# EAGLE design Lighting Schematic (EAGLE 9.1.3)
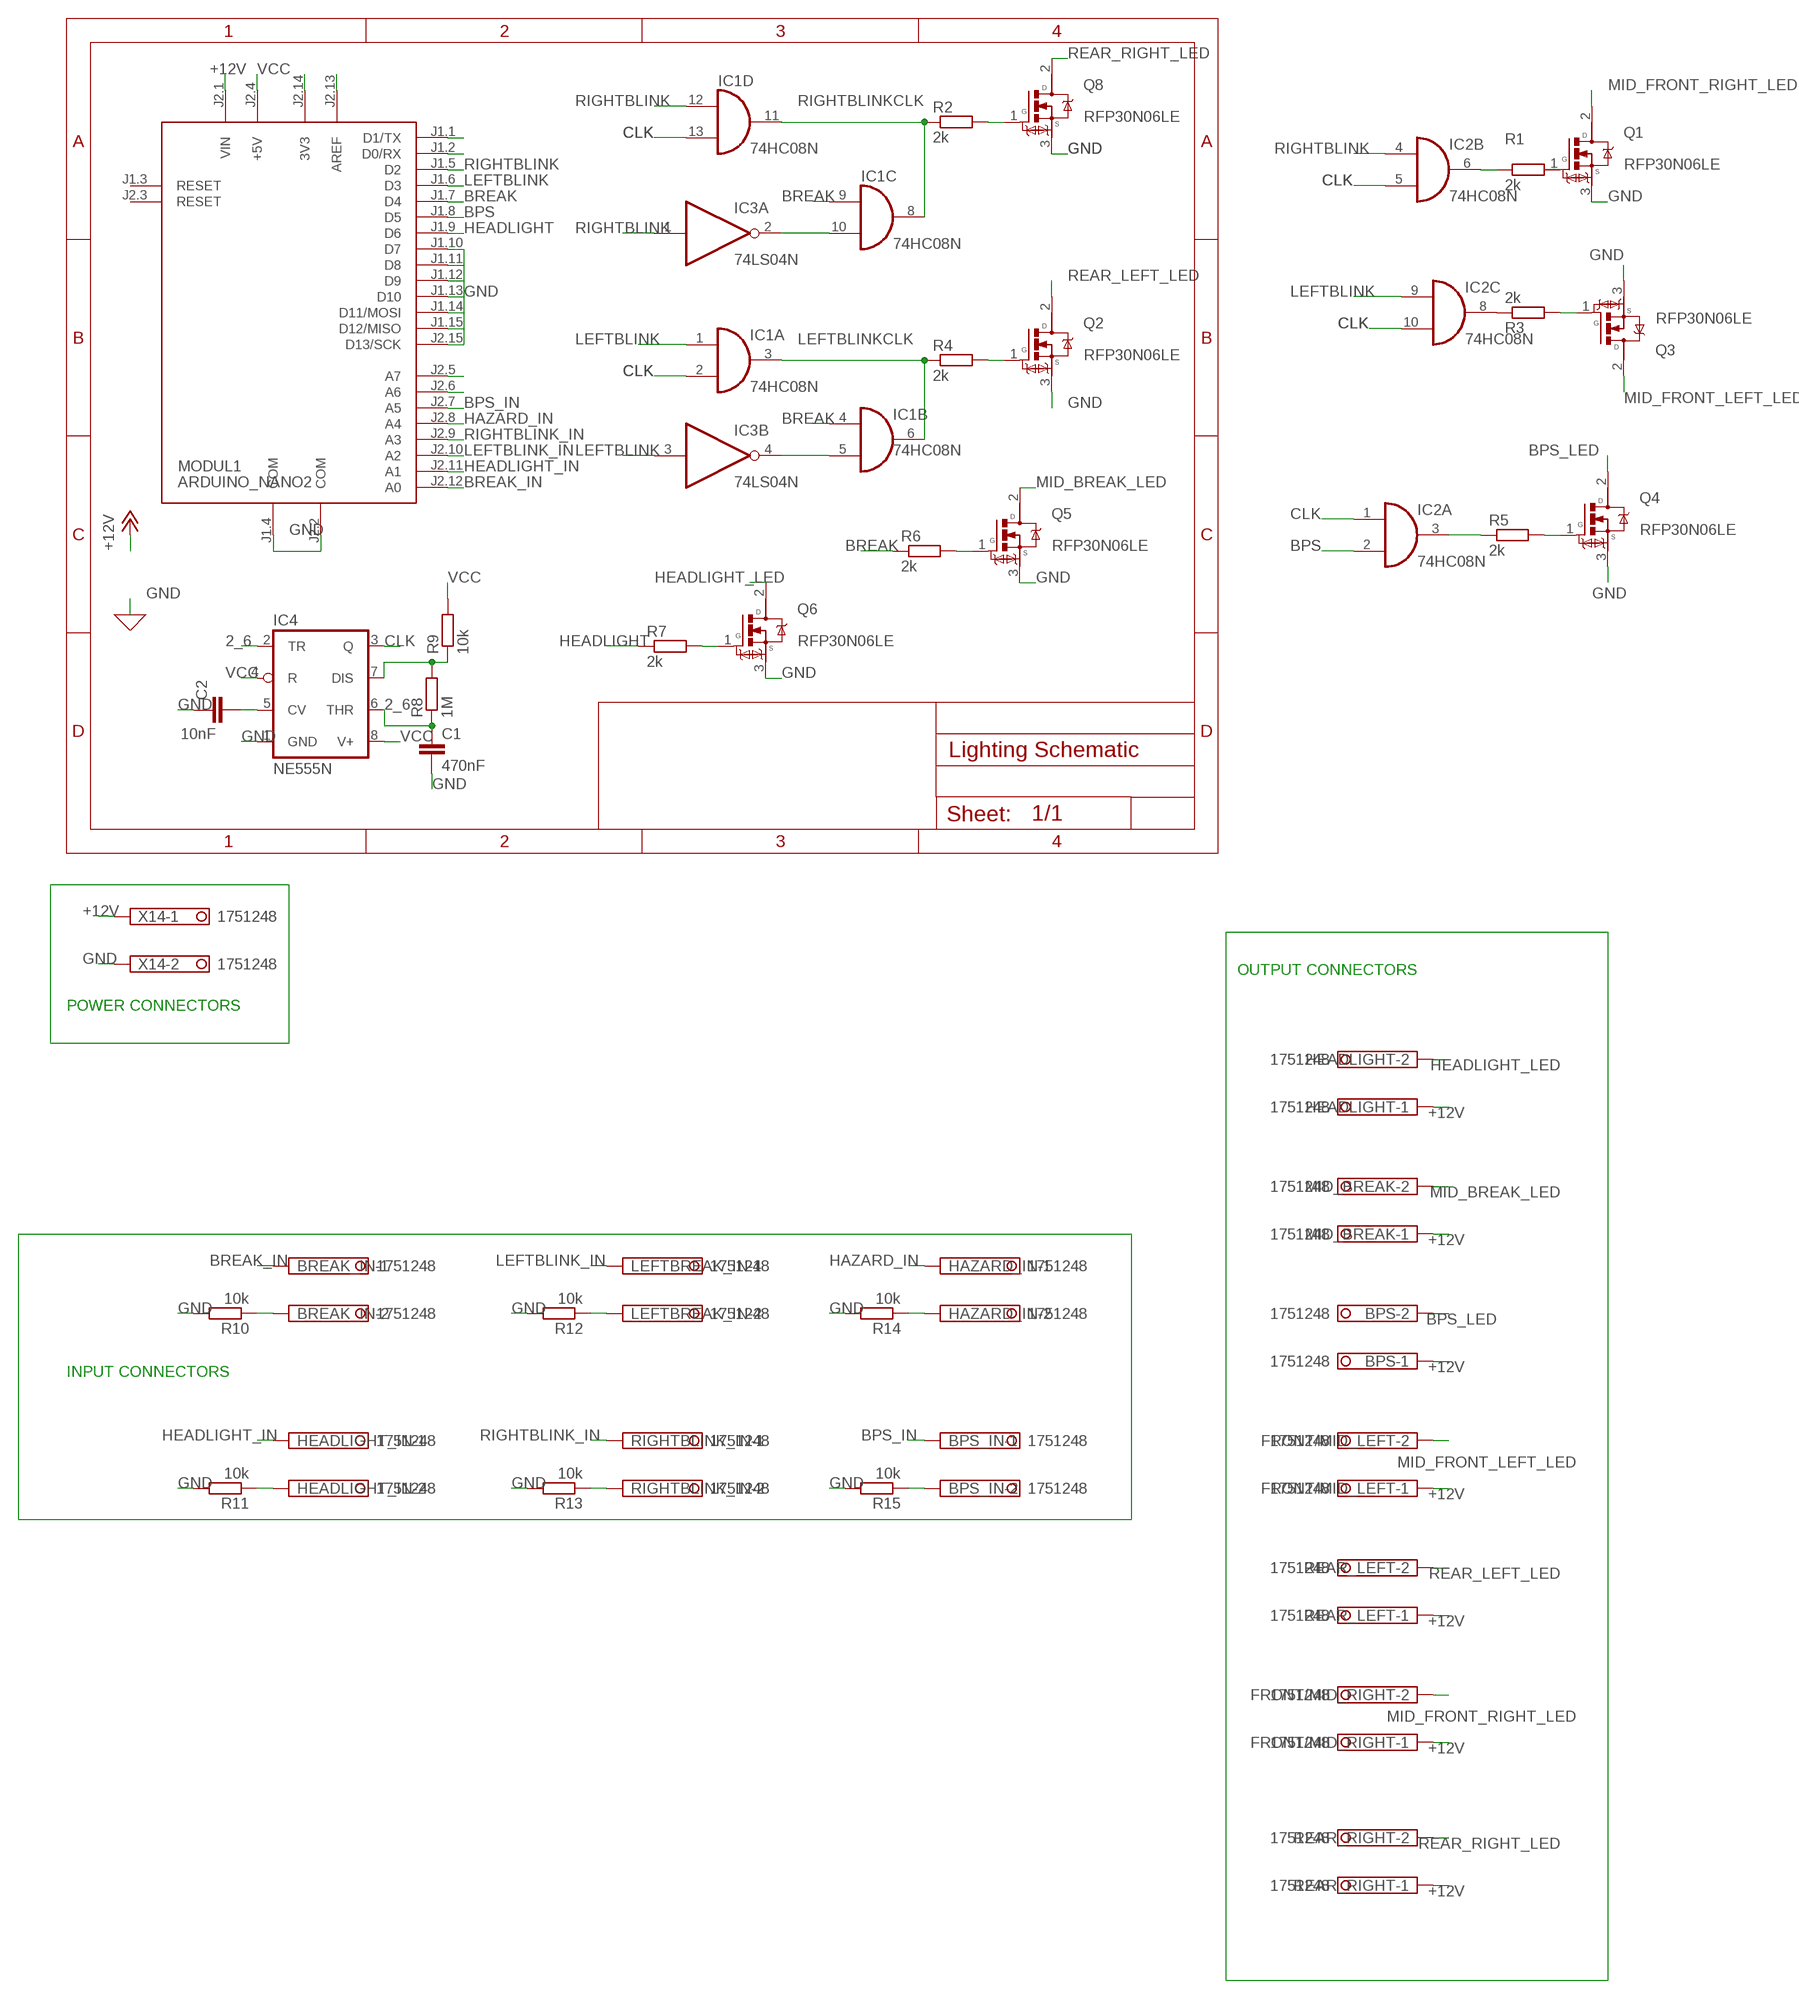
[diagram p0: schematic, sheet 1]

## Parts
BPS  1751248  [1751248]
BPS_IN  1751248  [1751248]
BREAK_IN  1751248  [1751248]
C1  470nF  C2.5/2  [C2.5-2]
C2  10nF  C2.5/2  [C2.5-2]
FRONT/MID_LEFT  1751248  [1751248]
FRONT/MID_RIGHT  1751248  [1751248]
HAZARD_IN  1751248  [1751248]
HEADLIGHT  1751248  [1751248]
HEADLIGHT_IN  1751248  [1751248]
IC1  74HC08N  [DIL14]
IC2  74HC08N  [DIL14]
IC3  74LS04N  [DIL14]
IC4  NE555N  [DIL08]
LEFTBREAK_IN  1751248  [1751248]
MID_BREAK  1751248  [1751248]
MODUL1  ARDUINO_NANO2  [ARDUINO_NANO2]
Q1  RFP30N06LE  [TRANS_RFP30N06LE]
Q2  RFP30N06LE  [TRANS_RFP30N06LE]
Q3  RFP30N06LE  [TRANS_RFP30N06LE]
Q4  RFP30N06LE  [TRANS_RFP30N06LE]
Q5  RFP30N06LE  [TRANS_RFP30N06LE]
Q6  RFP30N06LE  [TRANS_RFP30N06LE]
Q8  RFP30N06LE  [TRANS_RFP30N06LE]
R1  2k  R-EU_0204/5  [0204/5]
R2  2k  R-EU_0204/5  [0204/5]
R3  2k  R-EU_0204/5  [0204/5]
R4  2k  R-EU_0204/5  [0204/5]
R5  2k  R-EU_0204/5  [0204/5]
R6  2k  R-EU_0204/5  [0204/5]
R7  2k  R-EU_0204/5  [0204/5]
R8  1M  R-EU_0204/5  [0204/5]
R9  10k  R-EU_0204/5  [0204/5]
R10  10k  R-EU_0204/5  [0204/5]
R11  10k  R-EU_0204/5  [0204/5]
R12  10k  R-EU_0204/5  [0204/5]
R13  10k  R-EU_0204/5  [0204/5]
R14  10k  R-EU_0204/5  [0204/5]
R15  10k  R-EU_0204/5  [0204/5]
REAR_LEFT  1751248  [1751248]
REAR_RIGHT  1751248  [1751248]
RIGHTBLINK_IN  1751248  [1751248]
X14  1751248  [1751248]

## Nets
2_6: C1.1 IC4.2(TR) IC4.6(THR) R8.1
+12V: BPS.1 FRONT/MID_LEFT.1 FRONT/MID_RIGHT.1 HEADLIGHT.1 MID_BREAK.1 MODUL1.J2.1(VIN) REAR_LEFT.1 REAR_RIGHT.1 X14.1
BPS: IC2.2(A:I1) MODUL1.J1.8(D5)
BPS_IN: BPS_IN.1 MODUL1.J2.7(A5)
BPS_LED: BPS.2 Q4.2(D)
BREAK: IC1.4(B:I0) IC1.9(C:I0) MODUL1.J1.7(D4) R6.1
BREAK_IN: BREAK_IN.1 MODUL1.J2.12(A0)
CLK: IC1.2(A:I1) IC1.13(D:I1) IC2.1(A:I0) IC2.5(B:I1) IC2.10(C:I1) IC4.3(Q)
GND: C1.2 C2.1 IC4.1(GND) MODUL1.J1.4(COM) MODUL1.J1.10(D7) MODUL1.J2.2(COM) MODUL1.J2.15(D13/SCK) Q1.3(S) Q2.3(S) Q3.3(S) Q4.3(S) Q5.3(S) Q6.3(S) Q8.3(S) R10.2 R11.2 R12.2 R13.2 R14.2 R15.2 X14.2
HAZARD_IN: HAZARD_IN.1 MODUL1.J2.8(A4)
HEADLIGHT: MODUL1.J1.9(D6) R7.1
HEADLIGHT_IN: HEADLIGHT_IN.1 MODUL1.J2.11(A1)
HEADLIGHT_LED: HEADLIGHT.2 Q6.2(D)
LEFTBLINK: IC1.1(A:I0) IC2.9(C:I0) IC3.3(B:I) MODUL1.J1.6(D3)
LEFTBLINK_IN: LEFTBREAK_IN.1 MODUL1.J2.10(A2)
LEFTBLINKCLK: IC1.3(A:O) IC1.6(B:O) R4.1
MID_BREAK_LED: MID_BREAK.2 Q5.2(D)
MID_FRONT_LEFT_LED: FRONT/MID_LEFT.2 Q3.2(D)
MID_FRONT_RIGHT_LED: FRONT/MID_RIGHT.2 Q1.2(D)
N$1: Q8.1(G) R2.2
N$2: IC1.10(C:I1) IC3.2(A:O)
N$3: IC2.6(B:O) R1.1
N$4: IC1.5(B:I1) IC3.4(B:O)
N$5: IC4.7(DIS) R8.2 R9.1
N$6: Q2.1(G) R4.2
N$7: Q1.1(G) R1.2
N$8: Q3.1(G) R3.2
N$9: Q4.1(G) R5.2
N$10: IC2.3(A:O) R5.1
N$11: Q5.1(G) R6.2
N$12: Q6.1(G) R7.2
N$13: IC2.8(C:O) R3.1
N$28: MODUL1.J1.15(D12/MISO)
N$29: MODUL1.J1.14(D11/MOSI)
N$30: MODUL1.J1.13(D10)
N$31: MODUL1.J1.12(D9)
N$32: MODUL1.J1.11(D8)
N$34: C2.2 IC4.5(CV)
N$39: MODUL1.J1.2(D0/RX)
N$40: MODUL1.J1.1(D1/TX)
N$41: MODUL1.J2.5(A7)
N$42: MODUL1.J2.6(A6)
N$46: BREAK_IN.2 R10.1
N$48: HEADLIGHT_IN.2 R11.1
N$50: LEFTBREAK_IN.2 R12.1
N$51: MODUL1.J2.14(3V3)
N$52: MODUL1.J2.13(AREF)
N$54: R13.1 RIGHTBLINK_IN.2
N$56: HAZARD_IN.2 R14.1
N$58: BPS_IN.2 R15.1
REAR_LEFT_LED: Q2.2(D) REAR_LEFT.2
REAR_RIGHT_LED: Q8.2(D) REAR_RIGHT.2
RIGHTBLINK: IC1.12(D:I0) IC2.4(B:I0) IC3.1(A:I) MODUL1.J1.5(D2)
RIGHTBLINK_IN: MODUL1.J2.9(A3) RIGHTBLINK_IN.1
RIGHTBLINKCLK: IC1.8(C:O) IC1.11(D:O) R2.1
VCC: IC4.4(R) IC4.8(V+) MODUL1.J2.4(+5V) R9.2
Unconnected: IC2.11(D:O) IC2.12(D:I0) IC2.13(D:I1) IC3.5(C:I) IC3.6(C:O) IC3.8(D:O) IC3.9(D:I) IC3.10(E:O) IC3.11(E:I) IC3.12(F:O) IC3.13(F:I) MODUL1.J1.3(RESET) MODUL1.J2.3(RESET)

## Notes on the sheet
- OUTPUT CONNECTORS
- POWER CONNECTORS
- INPUT CONNECTORS

## Power pins joined to a net without a drawn wire
GND: IC1.7(P:GND) IC2.7(P:GND) IC3.7(P:GND)
VCC: IC1.14(P:VCC) IC2.14(P:VCC) IC3.14(P:VCC)

## Library data of the parts
BPS BPS_IN BREAK_IN FRONT/MID_LEFT FRONT/MID_RIGHT HAZARD_IN HEADLIGHT HEADLIGHT_IN LEFTBREAK_IN MID_BREAK REAR_LEFT REAR_RIGHT RIGHTBLINK_IN X14 = con-phoenix-350:1751248: MKDS 1/ 2-3,5 Printklemme Nennstrom: 10 A Bemessungsspannung: 160 V Raster: 3,5 mm Polzahl: 2 Montageart: Löten Anschlussart: Schraubanschluss Anschlussrichtung vom Leiter zur Platine: 0° Source: http://eshop.phoenixcontact.com .. 1751248.pdf; OC_FARNELL: unknown; OC_NEWARK: unknown
C1 C2 = capacitor-wima:C: CAPACITOR naming: grid - package width
IC1 IC2 = 74xx-eu:74*08: Quad 2-input AND gate
IC3 = 74xx-eu:74*04: Hex INVERTER
IC4 = linear:*555: TIMER
MODUL1 = arduino:ARDUINO_NANO2: Arduino Nano2 Auto generated by modulcreator.ulp \;; ANZAHL: 2; MODUL: TRUE; STECKX0: -76200; STECKX1: 76200; STECKY0: 177800; STECKY1: 177800
Q1-Q6 Q8 = RFP30N06LE:RFP30N06LE: Mosfet n-Ch 60v 30a To-220ab - Rfp30n06le; AVAILABILITY: Unavailable; DESCRIPTION: MOSFET N-CH 60V 30A TO-220AB; MF: ON Semiconductor; MP: RFP30N06LE; PACKAGE: TO-220 Intersil; PRICE: None
R1-R15 = rcl:R-EU_: RESISTOR, European symbol; SPICEPREFIX: R

## Board
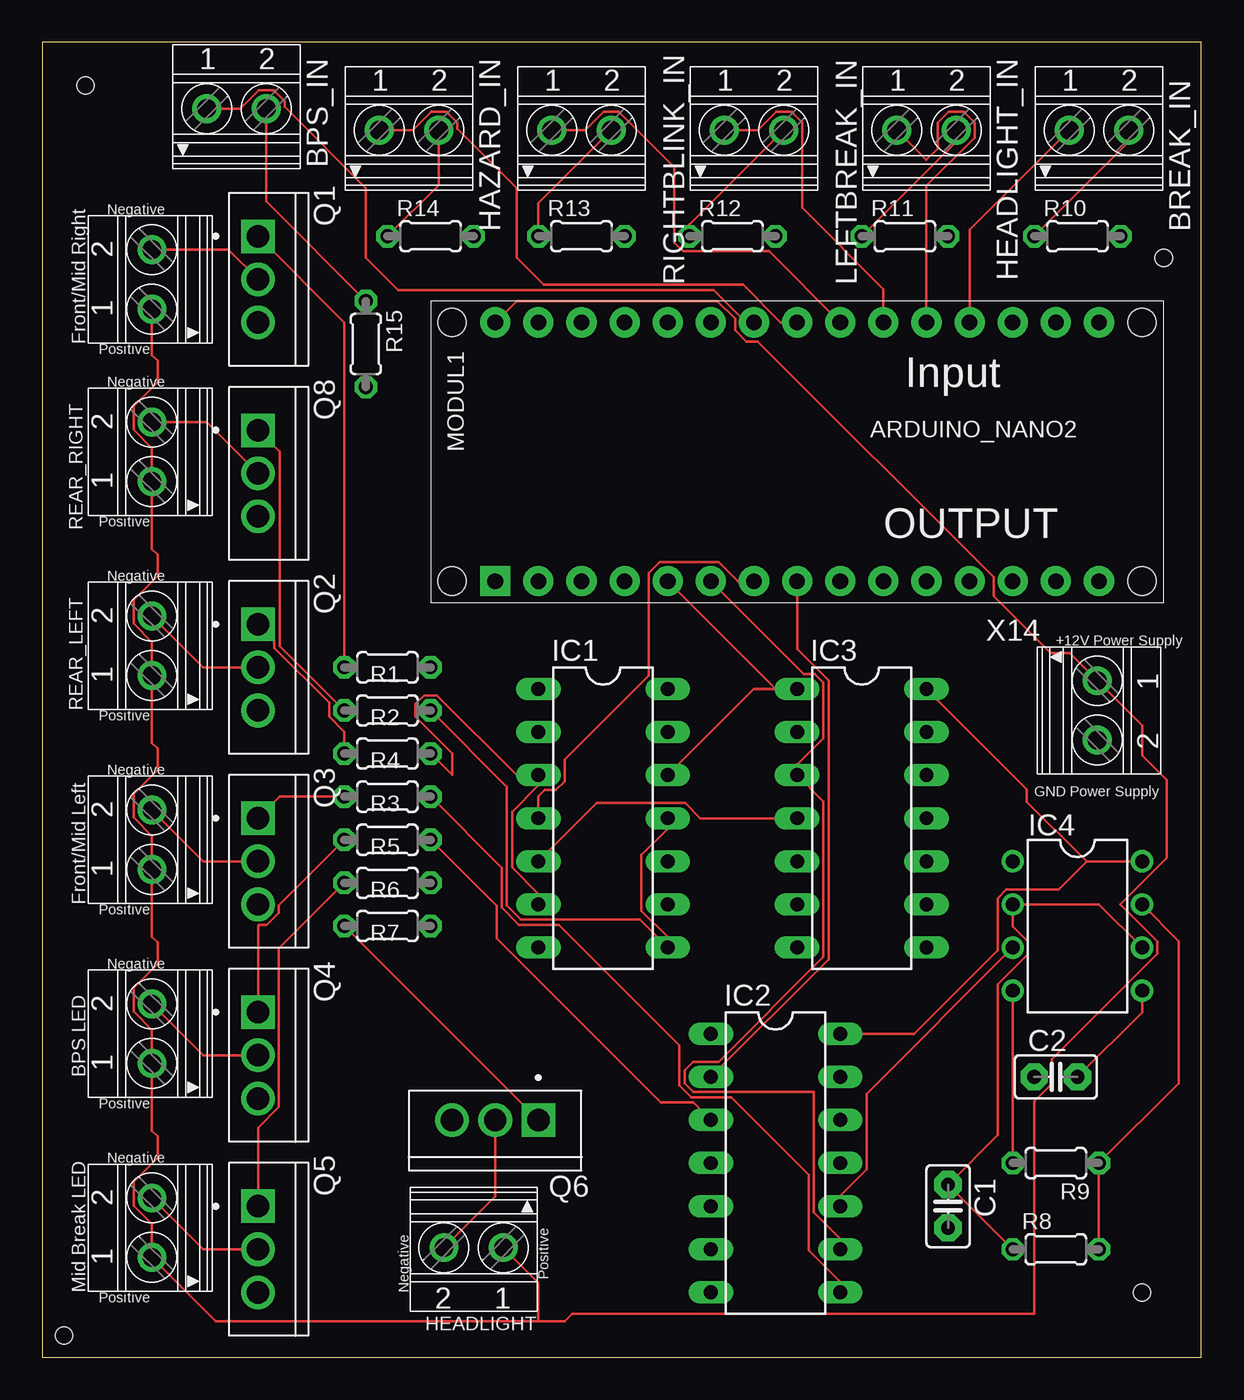
[diagram p1: board, top side]
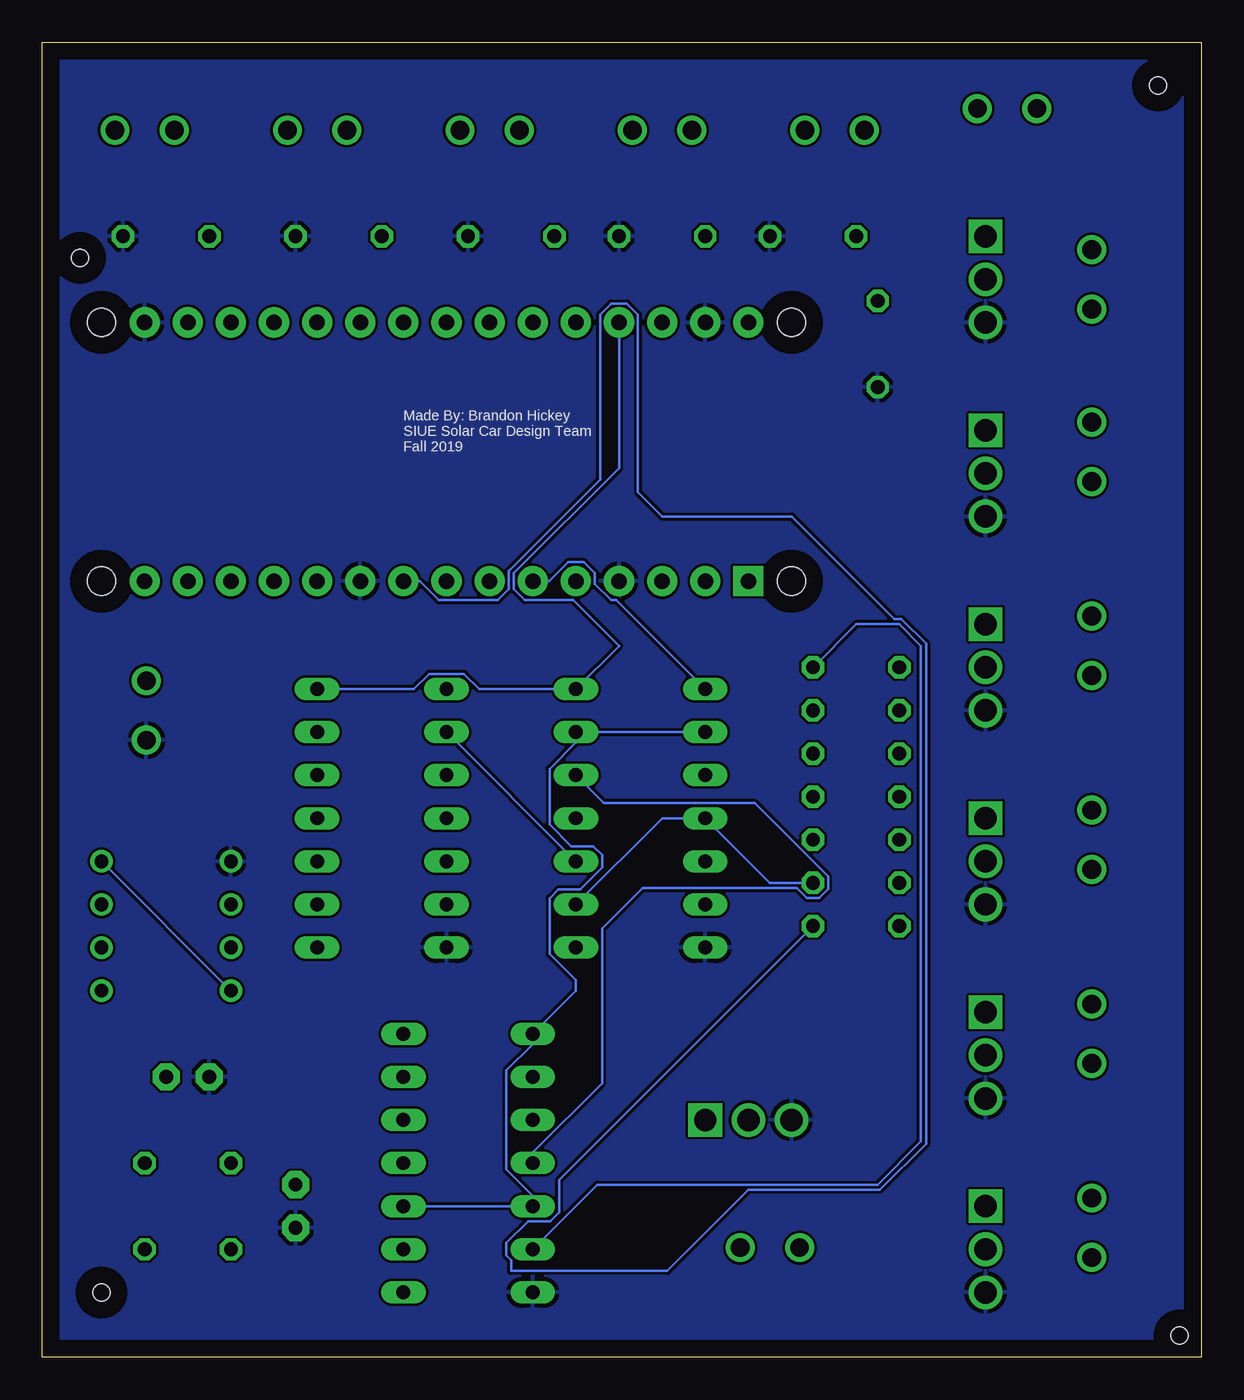
[diagram p2: board, bottom side, seen from below]

Size 68.25 x 77.46 mm. Coordinates in mm from the lower left corner, seen from the top.
Outline: 0,0 68.25,0 68.25,77.46 0,77.46 0,0
Copper layers (1*16): Top 0.035mm / dielectric 1.5mm / Bottom 0.035mm
Design rules "default": minimum track width 6mil, minimum drill 0.35mm, track to track 6mil, track to pad 6mil, pad to pad 6mil, via to via 6mil, smd to smd 6mil, copper to edge 40mil, drill to drill 6mil, minimum pad ring 10mil, minimum via ring 8mil, stop-mask expansion 4mil, vias tented up to drill 0mil, thermal gap 10mil
Holes 1 mm at 64.77,3.81 66.04,64.77 2.54,74.93 1.27,1.27

### Footprints (pad centres in the part's own frame; a part is rotated, then mirrored left to right if it is on the bottom)
1751248 = drill 1.1 pad 1.7: 1 -1.75,-0.1; 2 1.75,-0.1
C2.5-2 = drill 0.813 pad 1.6 octagon: 1 -1.27,0; 2 1.27,0
DIL14 = drill 0.813 long: 1 -7.62,-3.81; 2 -5.08,-3.81; 3 -2.54,-3.81; 4 0,-3.81; 5 2.54,-3.81; 6 5.08,-3.81; 7 7.62,-3.81; 8 7.62,3.81; 9 5.08,3.81; 10 2.54,3.81; 11 0,3.81; 12 -2.54,3.81; 13 -5.08,3.81; 14 -7.62,3.81
DIL08 = drill 0.813 pad 1.27: 1 -3.81,-3.81; 2 -1.27,-3.81; 3 1.27,-3.81; 4 3.81,-3.81; 5 3.81,3.81; 6 1.27,3.81; 7 -1.27,3.81; 8 -3.81,3.81
ARDUINO_NANO2 = drill 0.914 pad 1.778 square: J1.1 -7.62,17.78 | drill 0.914 pad 1.778: J1.2 -7.62,15.24; J1.3 -7.62,12.7; J1.4 -7.62,10.16; J1.5 -7.62,7.62; J1.6 -7.62,5.08; J1.7 -7.62,2.54; J1.8 -7.62,0; J1.9 -7.62,-2.54; J1.10 -7.62,-5.08; J1.11 -7.62,-7.62; J1.12 -7.62,-10.16; J1.13 -7.62,-12.7; J1.14 -7.62,-15.24; J1.15 -7.62,-17.78; J2.1 7.62,17.78; J2.2 7.62,15.24; J2.3 7.62,12.7; J2.4 7.62,10.16; J2.5 7.62,7.62; J2.6 7.62,5.08; J2.7 7.62,2.54; J2.8 7.62,0; J2.9 7.62,-2.54; J2.10 7.62,-5.08; J2.11 7.62,-7.62; J2.12 7.62,-10.16; J2.13 7.62,-12.7; J2.14 7.62,-15.24; J2.15 7.62,-17.78 | hole 1.651: -7.62,-20.32; 7.62,-20.32; 7.62,20.32; -7.62,20.32
TRANS_RFP30N06LE = drill 1.32 square: 1 -2.54,0 | drill 1.32: 2 0,0; 3 2.54,0
0204/5 = drill 0.813 octagon: 1 -2.54,0; 2 2.54,0

### Placement (x,y rotation side)
BPS  6.35,19.05 90 top
BPS_IN  11.43,73.66 0 top
BREAK_IN  62.23,72.39 0 top
C1  53.34,8.89 270 top
C2  59.69,16.51 0 top
FRONT/MID_LEFT  6.35,30.48 90 top
FRONT/MID_RIGHT  6.35,63.5 90 top
HAZARD_IN  21.59,72.39 0 top
HEADLIGHT  25.4,6.35 180 top
HEADLIGHT_IN  52.07,72.39 0 top
IC1  33.02,31.75 270 top
IC2  43.18,11.43 270 top
IC3  48.26,31.75 270 top
IC4  60.96,25.4 270 top
LEFTBREAK_IN  41.91,72.39 0 top
MID_BREAK  6.35,7.62 90 top
MODUL1  44.45,53.34 90 top
Q1  12.7,63.5 270 top
Q2  12.7,40.64 270 top
Q3  12.7,29.21 270 top
Q4  12.7,17.78 270 top
Q5  12.7,6.35 270 top
Q6  26.67,13.97 180 top
Q8  12.7,52.07 270 top
R1  20.32,40.64 180 top
R2  20.32,38.1 180 top
R3  20.32,33.02 180 top
R4  20.32,35.56 180 top
R5  20.32,30.48 180 top
R6  20.32,27.94 180 top
R7  20.32,25.4 180 top
R8  59.69,6.35 0 top
R9  59.69,11.43 180 top
R10  60.96,66.04 0 top
R11  50.8,66.04 0 top
R12  40.64,66.04 0 top
R13  31.75,66.04 0 top
R14  22.86,66.04 0 top
R15  19.05,59.69 270 top
REAR_LEFT  6.35,41.91 90 top
REAR_RIGHT  6.35,53.34 90 top
RIGHTBLINK_IN  31.75,72.39 0 top
X14  62.23,38.1 270 top

### Tracks (layer width: path | path; a pad name or v marks a point on that pad's centre or on a via)
2_6
  Top 0.152: R8.1 C1.1 56.26,13.08 56.26,21.96 58.04,23.74 58.04,24.5 57.15,25.39 IC4.2 62.23,26.67 IC4.6
+12V
  Top 0.152: MODUL1.J2.1 27.94,62.23 39.75,62.23 40.79,61.19 40.79,60.5 41.45,59.84 42.14,59.84 56.03,45.95 56.03,44.84 59.39,41.48 60.5,41.48 X14.1 64.77,37.21 64.77,35.45 66.22,33.99 66.22,29.41 63.49,26.67 65.66,24.5 65.66,23.76 59.45,17.55 59.45,16.08 58.42,15.05 58.42,2.54 31.21,2.54 30.78,2.11 29.21,2.11 | FRONT/MID_RIGHT.1 6.45,59.05 6.78,58.72 6.78,57.45 5.37,56.04 5.37,54.64 6.45,53.56 REAR_RIGHT.1 6.45,47.62 6.78,47.29 6.78,46.02 5.37,44.61 5.37,43.21 6.45,42.13 REAR_LEFT.1 6.45,36.19 6.78,35.86 6.78,34.59 5.37,33.18 5.37,31.78 6.45,30.7 FRONT/MID_LEFT.1 6.45,24.76 6.78,24.43 6.78,23.16 5.37,21.75 5.37,20.35 6.45,19.27 BPS.1 6.45,13.33 6.78,13 6.78,11.73 5.37,10.32 5.37,8.92 6.45,7.84 MID_BREAK.1 10.21,2.11 29.21,2.11 | HEADLIGHT.1 29.21,4.39 29.21,2.11
BPS
  Top 0.152: MODUL1.J1.8 44.45,41.72 46.3,39.86 46.3,23.44 IC2.2
BPS_IN
  Top 0.152: BPS_IN.1 11.65,73.56 12.73,74.64 13.63,74.64 14.26,74.01 14.26,73.66 19.05,68.87 19.05,64.77 20.94,62.88 39.53,62.88 41.45,60.96 MODUL1.J2.7
BPS_LED
  Top 0.152: BPS.2 9.47,17.78 Q4.2
BREAK
  Top 0.152: IC1.4 29.21,33.02 29.59,33.4 30.24,33.4 30.76,33.92 30.76,35.22 35.71,40.17 35.71,46.18 36.37,46.84 39.83,46.84 40.95,45.72 MODUL1.J1.7
  Bottom 0.152: IC1.9 31.75,31.75 IC1.4 25.4,27.94 R6.1
BREAK_IN
  Top 0.152: BREAK_IN.1 54.61,66.42 MODUL1.J2.12
CLK
  Top 0.152: IC4.3 48.54,15.52 48.54,11.06 46.99,9.51 IC2.10
  Bottom 0.152: IC1.2 IC1.13 36.83,36.21 38.38,34.66 38.38,31.38 37.1,30.1 35.8,30.1 35.28,29.58 35.28,28.84 36.56,27.56 37.86,27.56 38.38,27.04 38.38,23.76 36.83,22.21 36.83,21.59 IC2.1 39.37,18.43 40.92,16.88 40.92,11.06 39.37,9.51 IC2.5 IC2.10
GND
  pour Bottom: 0,77.47 68.58,77.47 68.58,0 0,0
HAZARD_IN
  Top 0.152: HAZARD_IN.1 21.82,72.29 22.89,73.37 23.79,73.37 24.42,72.74 24.42,72.39 27.94,68.87 27.94,64.77 29.53,63.18 41.27,63.18 43.49,60.96 MODUL1.J2.8
HEADLIGHT
  Bottom 0.152: MODUL1.J1.9 46.03,45.72 44.91,44.6 41.45,44.6 40.79,45.26 40.79,46.31 35.41,51.69 35.41,61.42 34.75,62.08 33.83,62.08 33.17,61.42 33.17,50.95 31.75,49.53 24.13,49.53 18.09,43.48 17.65,43.48 16.2,42.04 16.2,12.57 18.92,9.86 26.67,9.86 31.45,5.08 40.64,5.08 40.64,5.7 40.92,5.98 40.92,6.72 39.64,8 38.34,8 37.82,8.52 37.82,10.44 R7.1
HEADLIGHT_IN
  Top 0.152: HEADLIGHT_IN.1 52.07,70.54 52.74,71.21 52.74,72.74 53.37,73.37 54.27,73.37 54.9,72.74 54.9,71.84 52.07,69.02 MODUL1.J2.11
HEADLIGHT_LED
  Top 0.152: Q6.2 26.67,9.47 HEADLIGHT.2
LEFTBLINK
  Top 0.152: MODUL1.J1.6 44.83,40.26 45.48,40.26 46,39.74 46,36.46 44.45,34.91 IC3.3 46,32.74 46,23.57 39.83,17.4 38.34,17.4 37.82,16.88 37.82,16.14 38.34,15.62 45.44,15.62 45.44,8.52 46.99,6.97 IC2.9
  Bottom 0.152: IC1.1 34.44,44.6 34.75,44.6 35.71,45.56 35.71,46.18 36.37,46.84 37.29,46.84 38.41,45.72 MODUL1.J1.6
LEFTBLINK_IN
  Top 0.152: MODUL1.J2.10 49.53,62.92 44.74,67.71 44.74,72.74 44.11,73.37 43.21,73.37 42.13,72.29 LEFTBREAK_IN.1
LEFTBLINKCLK
  Top 0.152: IC1.6 29.21,27.29 27.66,28.84 27.66,32.12 29.21,33.67 IC1.3 27.93,34.29 23.23,38.99 22.49,38.99 21.97,38.47 21.97,37.73 24.13,35.57 24.13,34.29 R4.1
MID_BREAK_LED
  Top 0.152: MID_BREAK.2 9.47,6.35 Q5.2
MID_FRONT_LEFT_LED
  Top 0.152: FRONT/MID_LEFT.2 9.47,29.21 Q3.2
MID_FRONT_RIGHT_LED
  Top 0.152: Q1.2 10.95,65.25 FRONT/MID_RIGHT.2
N$1
  Top 0.152: R2.2 13.97,41.91 13.97,53.34 Q8.1
N$2
  Bottom 0.152: IC3.2 IC1.10
N$3
  Bottom 0.152: IC2.6 35.56,10.16 19.05,10.16 16.51,12.7 16.51,41.91 17.78,43.18 20.32,43.18 R1.1
N$4
  Top 0.152: IC3.4 38.75,31.75 37.86,32.64 32.64,32.64 IC1.5
N$5
  Top 0.152: IC4.7 64.77,26.66 66.93,24.5 66.93,16.13 R9.1 R8.2
N$6
  Top 0.152: Q2.1 13.66,42.22 13.66,41.78 16.89,38.56 16.89,37.73 17.78,36.84 R4.2
N$7
  Top 0.152: R1.2 17.78,60.96 Q1.1
N$8
  Top 0.152: R3.2 13.97,33.02 Q3.1
N$9
  Top 0.152: Q4.1 12.7,25.4 12.75,25.45 13.21,25.45 13.92,26.16 13.92,26.62 R5.2
N$10
  Top 0.152: R5.1 26.75,26.59 26.75,24.68 36.41,15.01 38.33,15.01 IC2.3
N$11
  Top 0.152: Q5.1 12.7,13.52 13.92,14.73 13.92,24.08 R6.2
N$12
  Top 0.152: R7.2 Q6.1
N$13
  Top 0.152: R3.1 27.05,28.83 27.05,26.48 28.05,25.48 30.4,25.48 37.52,18.36 37.52,16.02 38.22,15.32 40.56,15.32 45.14,10.74 45.14,6.29 46.99,4.43 IC2.8
N$34
  Top 0.152: IC4.5 64.77,20.32 C2.2
N$46
  Top 0.152: R10.1 63.98,71.6 BREAK_IN.2
N$48
  Top 0.152: R11.1 53.82,71.6 HEADLIGHT_IN.2
N$50
  Top 0.152: R12.1 38.1,66.73 LEFTBREAK_IN.2
N$54
  Top 0.152: R13.1 29.21,68 RIGHTBLINK_IN.2
N$56
  Top 0.152: R14.1 23.34,69.06 HAZARD_IN.2
N$58
  Top 0.152: R15.1 13.18,68.1 BPS_IN.2
REAR_LEFT_LED
  Top 0.152: REAR_LEFT.2 9.47,40.64 Q2.2
REAR_RIGHT_LED
  Top 0.152: Q8.2 9.68,55.09 REAR_RIGHT.2
RIGHTBLINK
  Top 0.152: MODUL1.J1.5 43.18,39.37 IC3.1 41.91,39.37 IC1.12
  Bottom 0.152: IC2.4 39.37,12.05 35.28,16.14 35.28,25.25 32.89,27.64 23.81,27.64 23.23,27.05 22.49,27.05 21.97,27.57 21.97,28.31 26.3,32.64 35.18,32.64 IC1.12
RIGHTBLINK_IN
  Top 0.152: RIGHTBLINK_IN.1 31.98,72.29 33.05,73.37 33.95,73.37 37.21,70.1 37.21,65.67 37.73,65.15 42.8,65.15 MODUL1.J2.9
RIGHTBLINKCLK
  Top 0.152: IC1.11 36.83,31.13 35.28,29.58 35.28,26.3 36.83,24.75 IC1.8 35.18,25.78 28.18,25.78 27.36,26.61 27.36,33.6 R2.1
VCC
  Top 0.152: IC3.14 57.99,33.45 57.99,32.72 61.5,29.21 | IC4.8 61.5,29.21 | IC4.4 R9.2 | IC2.14 51.34,19.05 56.26,23.97 56.26,27.04 56.78,27.56 59.85,27.56 61.5,29.21
  Bottom 0.152: IC4.8 IC4.4 | IC3.14 46.37,39.37 45.48,40.26 43.42,40.26 42.53,39.37 IC1.14 34.29,41.91 36.98,44.6 39.83,44.6 40.49,45.26 40.49,46.18 34.29,52.38 MODUL1.J2.4

### Text on the board
tNames: Negative | Front/Mid Right | Positive | Negative | Input | Positive | OUTPUT | Negative | +12V Power Supply | Positive | Negative | GND Power Supply | Front/Mid Left | Positive | Negative | BPS LED | Positive | Negative | Positive | Mid Break LED | Positive | Negative
bNames: Made By: Brandon Hickey / SIUE Solar Car Design Team / Fall 2019